# EasyEDA Pro project grandPA2.eprj, board peripherals
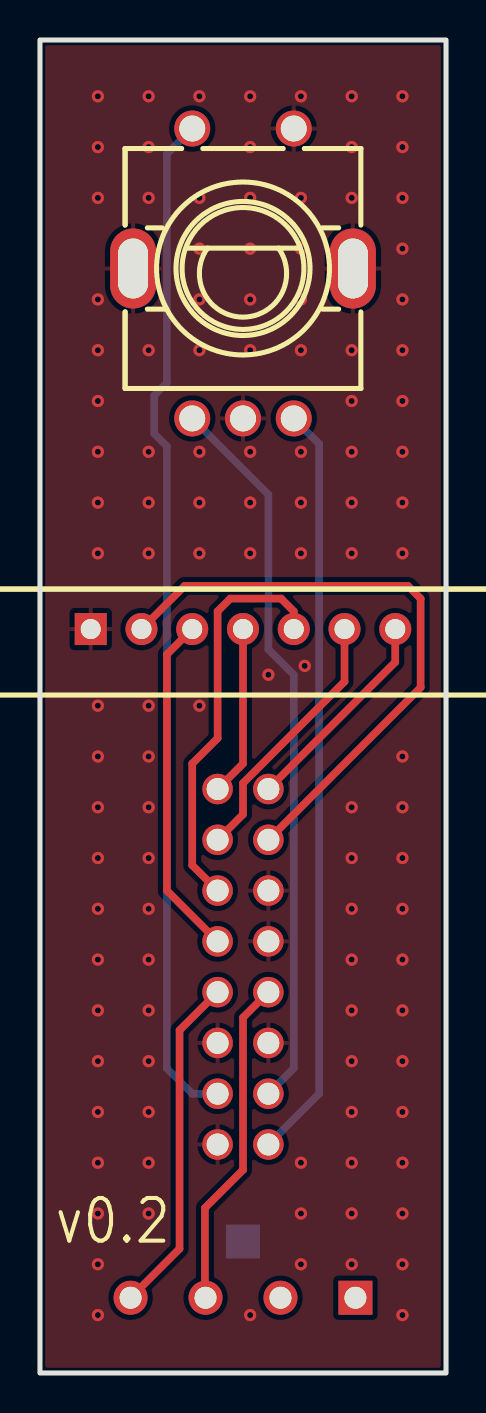
[diagram p10: board, top side]
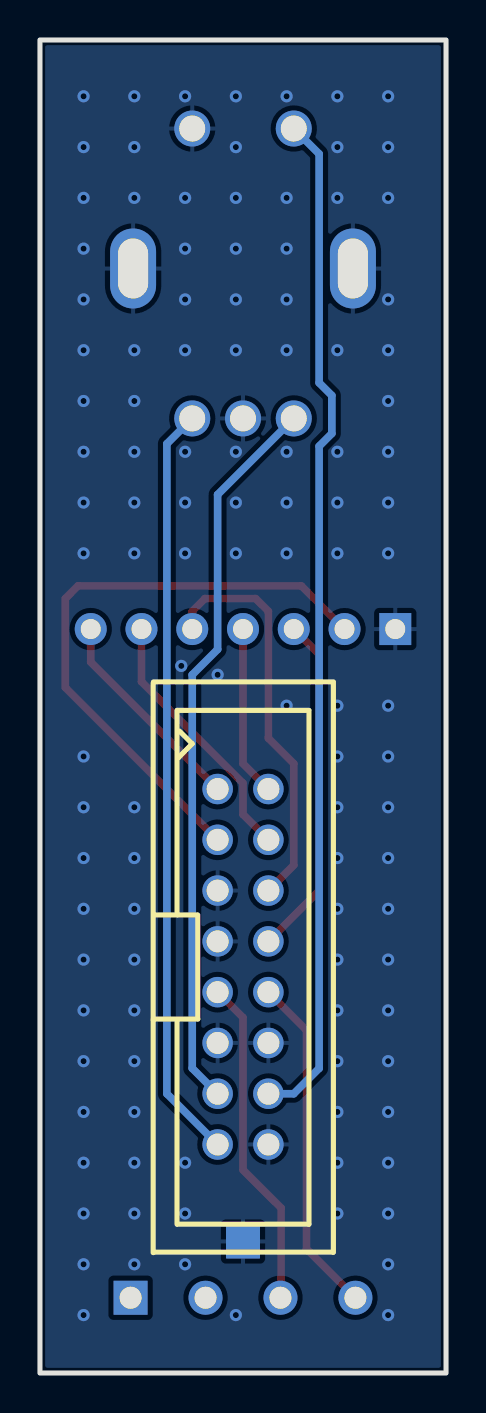
[diagram p11: board, bottom side, seen from below]

Outline 20.32 x 66.67 mm; copper layers: Top Layer, Bottom Layer. Coordinates in mm from the lower left corner of the outline.
Outline path: rectangle 0,66.67 20.32,0
Stack: Top Layer 0.035mm / Dielectric1 1.51mm FR4 er 4.5 / Bottom Layer 0.035mm

## Design rules (mm)
template: JLCPCB Capability(Two Layers Board)
spacing copperThickness1oz (default): track to track 0.102, other pairs 0.152 to 0.3
spacing copperThickness2oz: track to track 0.203, other pairs 0.152 to 0.3
track width copperThickness1oz (default): min 0.127, default 0.254, max 2.54
track width copperThickness2oz: min 0.203, default 0.254, max 2.54
differential pair differentialPair (default): width min 0.127, default 0.254, max 2.54; gap min 0.152, default 0.152
via viaSize (default): diameter min 0.5, default 0.61, max 10; hole min 0.3, default 0.305, max 6.3

## Placement (name value [footprint] x y rotation side)
H1  -  [HDR-TH_5P-P2.54-V-M]  10.16 3.76 180 bottom
OLED1  HS13L02W4S01  [OLED-TH_HS13L02W4S01]  10.16 37.21 0 top
P1  2.54-2*8P简牛  [IDC-TH_16P-P2.54_C3406]  10.16 20.32 270 bottom
SW2  -  [SW-TH_EC11XXXXXXXX]  10.16 55 0 top

## Footprints (pads in the part's own frame, mm; a bottom-side part is the same pattern mirrored in y, then rotated)
HDR-TH_5P-P2.54-V-M
  rect 1.7x1.7 hole 1.1: 1(-5.625,0)
  round 1.7 hole 1.1: 2(-1.875,0) 3(1.875,0) 4(5.625,0)
  rect 1.7x1.7 smd: 5(0,2.812)
IDC-TH_16P-P2.54_C3406
  round 1.524 hole 1.1: 1(-8.89,-1.27) 2(-8.89,1.27) 3(-6.35,-1.27) 4(-6.35,1.27) 5(-3.81,-1.27) 6(-3.81,1.27) 7(-1.27,-1.27) 8(-1.27,1.27) 9(1.27,-1.27) 10(1.27,1.27) 11(3.81,-1.27) 12(3.81,1.27) 13(6.35,-1.27) 14(6.35,1.27) 15(8.89,-1.27) 16(8.89,1.27)
OLED-TH_HS13L02W4S01
  rect 1.6x1.6 hole 1: 1(-7.62,0)
  round 1.6 hole 1: 2(-5.08,0) 3(-2.54,0) 4(0,0) 5(2.54,0) 6(5.08,0) 7(7.62,0)
SW-TH_EC11XXXXXXXX
  oval 2.3x4 hole 1.5x3: 6(5.5,0.25) 7(-5.5,0.25)
  round 1.8 hole 1.3: A(-2.54,-7.25) B(2.54,-7.25) C(0,-7.25) D(-2.54,7.25) E(2.54,7.25)

## Nets
As in the schematic.

Pads without a net: H1 1 2

## Via types
v1: diameter 0.61, hole 0.305, Top Layer to Bottom Layer, 112 vias

## Routing (per net, layer and track width the routed paths; a pad name or vN(x,y) marks a point on that pad's centre or on a via; arc(x,y) is an arc through that point)
GND:
  vias: v1(2.9,63.86) v1(2.9,61.32) v1(2.9,58.78) v1(2.9,53.7) v1(2.9,51.16) v1(2.9,48.62) v1(2.9,46.08) v1(2.9,43.54) v1(2.9,41) v1(2.9,33.38) v1(2.9,30.84) v1(2.9,28.3) v1(2.9,25.76) v1(2.9,23.22) v1(2.9,20.68) v1(2.9,18.14) v1(2.9,15.6) v1(2.9,13.06) v1(2.9,10.52) v1(2.9,7.98) v1(2.9,5.44) v1(2.9,2.9) v1(5.44,63.86) v1(5.44,61.32) v1(5.44,58.78) v1(5.44,51.16) v1(5.44,46.08) v1(5.44,43.54) v1(5.44,41) v1(5.44,33.38) v1(5.44,30.84) v1(5.44,28.3) v1(5.44,25.76) v1(5.44,23.22) v1(5.44,20.68) v1(5.44,18.14) v1(5.44,15.6) v1(5.44,13.06) v1(5.44,10.52) v1(5.44,7.98) v1(7.98,63.86) v1(7.98,58.78) v1(7.98,56.24) v1(7.98,53.7) v1(7.98,51.16) v1(7.98,46.08) v1(7.98,43.54) v1(7.98,41) v1(7.98,33.38) v1(10.52,63.86) v1(10.52,61.32) v1(10.52,58.78) v1(10.52,56.24) v1(10.52,53.7) v1(10.52,51.16) v1(10.52,46.08) v1(10.52,43.54) v1(10.52,41) v1(10.52,2.9) v1(11.43,34.92) v1(13.06,63.86) v1(13.06,58.78) v1(13.06,56.24) v1(13.06,53.7) v1(13.06,51.16) v1(13.06,46.08) v1(13.06,43.54) v1(13.06,41) v1(13.06,10.52) v1(13.06,7.98) v1(13.06,5.44) v1(13.25,35.37) v1(15.6,63.86) v1(15.6,61.32) v1(15.6,58.78) v1(15.6,51.16) v1(15.6,48.62) v1(15.6,46.08) v1(15.6,43.54) v1(15.6,41) v1(15.6,28.3) v1(15.6,25.76) v1(15.6,23.22) v1(15.6,20.68) v1(15.6,18.14) v1(15.6,15.6) v1(15.6,13.06) v1(15.6,10.52) v1(15.6,7.98) v1(15.6,5.44) v1(18.14,63.86) v1(18.14,61.32) v1(18.14,58.78) v1(18.14,56.24) v1(18.14,53.7) v1(18.14,51.16) v1(18.14,48.62) v1(18.14,46.08) v1(18.14,43.54) v1(18.14,41) v1(18.14,30.84) v1(18.14,28.3) v1(18.14,25.76) v1(18.14,23.22) v1(18.14,20.68) v1(18.14,18.14) v1(18.14,15.6) v1(18.14,13.06) v1(18.14,10.52) v1(18.14,7.98) v1(18.14,5.44) v1(18.14,2.9)
VCC: length 30.3
  Top Layer w0.381: P1.3 19.05,34.29 19.05,38.73 18.41,39.37 7.24,39.37 OLED1.2
$1N1183: length 8.5
  Top Layer w0.381: OLED1.4 10.16,30.48 P1.2
$1N2859: length 17.2
  Top Layer w0.381: OLED1.3 6.35,35.94 6.35,24.13 P1.8
$1N2908: length 20.2
  Top Layer w0.381: OLED1.5 12.7,38.1 12.06,38.73 9.53,38.73 8.89,38.1 8.89,31.75 7.62,30.48 7.62,25.4 P1.6
$1N2911: length 13.2
  Top Layer w0.381: OLED1.6 15.24,34.58 10.16,29.5 10.16,27.94 P1.4
$1N2932: length 10.6
  Top Layer w0.381: OLED1.7 17.78,35.56 P1.1
$1N2949: length 17.1
  Top Layer w0.381: P1.10 6.98,17.14 6.98,6.21 H1.4
$1N2960: length 16.6
  Top Layer w0.381: H1.3 8.25,3.79 8.25,8.25 10.16,10.16 10.16,17.78 P1.9
$1N3145: length 51.1
  Bottom Layer w0.381: P1.14 7.62,13.97 6.35,15.24 6.35,46.35 5.72,46.99 5.72,48.89 6.35,49.53 6.35,60.98 SW2.D
$1N3518: length 37.9
  Bottom Layer w0.381: P1.15 13.97,13.97 13.97,46.48 SW2.B
$1N3527: length 36.4
  Bottom Layer w0.381: SW2.A 11.43,43.94 11.43,36.19 12.7,34.92 12.7,15.24 P1.13

## Copper pours and planes (outline as drawn; the poured copper is in the pictures)
GND on Top Layer: 0,66.67 20.32,66.67 20.32,0 0,0
GND on Bottom Layer: 0,66.67 20.32,66.67 20.32,0 0,0

## Text on the board
Top Silkscreen Layer: v0.2
